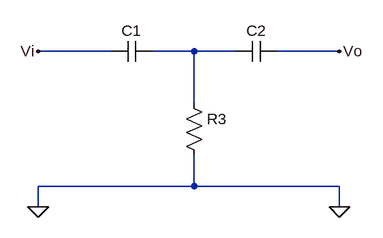
[diagram p0: schematic second_quadrupole.asc]
second_quadrupole.asc, the LTspice schematic file:
Version 4
SHEET 1 880 680
WIRE 96 80 -16 80
WIRE 224 80 160 80
WIRE 288 80 224 80
WIRE 448 80 352 80
WIRE 224 160 224 80
WIRE 224 288 224 240
WIRE 224 288 -16 288
WIRE 448 288 224 288
WIRE -16 320 -16 288
WIRE 448 320 448 288
FLAG -16 320 0
FLAG 448 320 0
FLAG -16 80 Vi
FLAG 448 80 Vo
SYMBOL cap 160 64 R90
WINDOW 0 0 32 VBottom 2
WINDOW 3 32 32 VTop 2
SYMATTR InstName C1
SYMATTR Value ""
SYMBOL cap 352 64 R90
WINDOW 0 0 32 VBottom 2
WINDOW 3 32 32 VTop 2
SYMATTR InstName C2
SYMATTR Value ""
SYMBOL res 208 144 R0
SYMATTR InstName R3
SYMATTR Value ""

The netlist it stands for:
* second_quadrupole.asc
C1 N001 Vi
C2 Vo N001
R3 N001 0
.backanno
.end